# EAGLE design EpaperTeensyBoard (EAGLE 6.3)
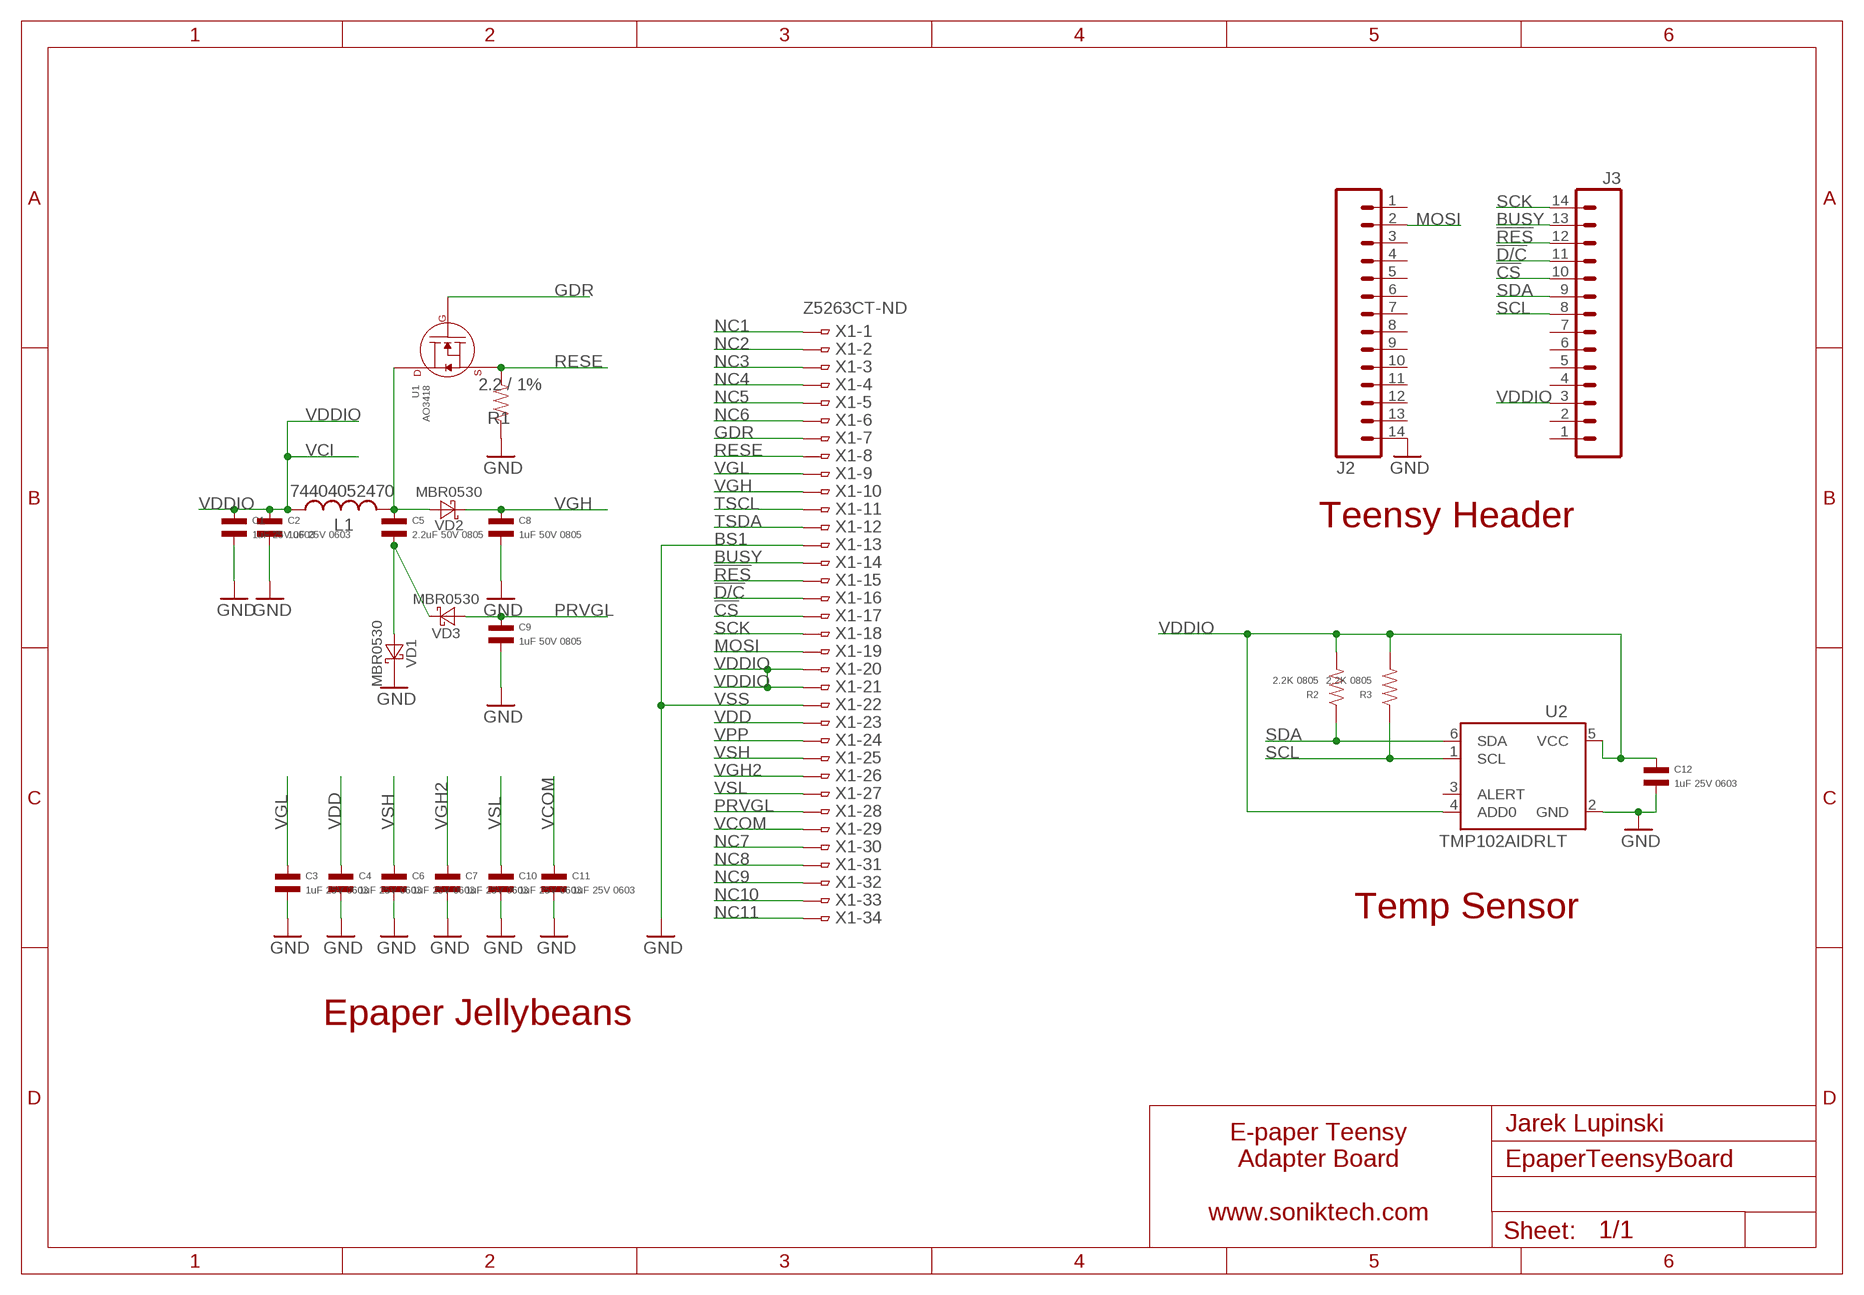
[diagram p0: schematic, sheet 1]

## Parts
C1  1uF 25V 0603  CAPACITOR_NP_0603  [C0603]
C2  1uF 25V 0603  CAPACITOR_NP_0603  [C0603]
C3  1uF 25V 0603  CAPACITOR_NP_0603  [C0603]
C4  1uF 25V 0603  CAPACITOR_NP_0603  [C0603]
C5  2.2uF 50V 0805  CAPACITOR_NP_0805  [C0805]
C6  1uF 25V 0603  CAPACITOR_NP_0603  [C0603]
C7  1uF 25V 0603  CAPACITOR_NP_0603  [C0603]
C8  1uF 50V 0805  CAPACITOR_NP_0805  [C0805]
C9  1uF 50V 0805  CAPACITOR_NP_0805  [C0805]
C10  1uF 25V 0603  CAPACITOR_NP_0603  [C0603]
C11  1uF 25V 0603  CAPACITOR_NP_0603  [C0603]
C12  1uF 25V 0603  CAPACITOR_NP_0603  [C0603]
J2  M14  [1X14]
J3  M14  [1X14]
L1  74404052470  L-USWE-TPC  [POWER-CHOKE_WE-TPC]
R1  2.2 / 1%  RESISTOR_0805  [R0805]
R2  2.2K 0805  RESISTOR_0805  [R0805]
R3  2.2K 0805  RESISTOR_0805  [R0805]
U1  AO3418  N-CHANNEL_FET_SOT-23-3  [SOT-23-3]
U2  TMP102AIDRLT  TMP102  [SOT563]
VD1  MBR0530  DIODE-SCHOTTKY-SOD123  [SOD123]
VD2  MBR0530  DIODE-SCHOTTKY-SOD123  [SOD123]
VD3  MBR0530  DIODE-SCHOTTKY-SOD123  [SOD123]
X1  Z5263CT-ND  FH12-34S-0.5S  [XF3M-34]

## Nets
!CS: J3.10 X1.17
!D/C: J3.11 X1.16
!RES: J3.12 X1.15
BUSY: J3.13 X1.14
GDR: U1.P$1(GATE) X1.7
GND [power]: C1.P$2 C2.P$2 C3.P$2 C4.P$2 C6.P$2 C7.P$2 C8.P$2 C9.P$2 C10.P$2 C11.P$2 C12.P$2 J2.14 R1.P$1 U2.2(GND) VD1.C X1.13 X1.22
MOSI: J2.2 X1.19
N$3: C5.P$1 L1.2 U1.P$3(DRAIN) VD2.A
N$6: C5.P$2 VD1.A VD3.C
NC1: X1.1
NC2: X1.2
NC3: X1.3
NC4: X1.4
NC5: X1.5
NC6: X1.6
NC7: X1.30
NC8: X1.31
NC9: X1.32
NC10: X1.33
NC11: X1.34
PRVGL: C9.P$1 VD3.A X1.28
RESE: R1.P$2 U1.P$2(SOURCE) X1.8
SCK: J3.14 X1.18
SCL: J3.8 R3.P$1 U2.1(SCL)
SDA: J3.9 R2.P$1 U2.6(SDA)
TSCL: X1.11
TSDA: X1.12
VCOM: C11.P$1 X1.29
VDD: C4.P$1 X1.23
VDDIO: C1.P$1 C2.P$1 C12.P$1 J3.3 L1.1 R2.P$2 R3.P$2 U2.4(ADD0) U2.5(VCC) X1.20 X1.21
VGH: C8.P$1 VD2.C X1.10
VGH2: C7.P$1 X1.26
VGL: C3.P$1 X1.9
VPP: X1.24
VSH: C6.P$1 X1.25
VSL: C10.P$1 X1.27
Unconnected: J2.1 J2.3 J2.4 J2.5 J2.6 J2.7 J2.8 J2.9 J2.10 J2.11 J2.12 J2.13 J3.1 J3.2 J3.4 J3.5 J3.6 J3.7 U2.3(ALERT)

## Notes on the sheet
- VCI
- Teensy Header
- BS1
- VSS
- Temp Sensor
- Epaper Jellybeans
- Jarek Lupinski
- E-paper Teensy
  Adapter Board
  
  www.soniktech.com

## Library data of the parts
C1-C12 = MF_Passives:CAPACITOR_NP: Library: MF_Passives Description: Device for Non-Polarized Capacitors. Manufacture part number (MPN) can be added via Attributes. Check https://factory.macrofab.com/parts for the house parts list.; POPULATE: 1
J2 J3 = SparkFun-Connectors:M14: Header 14 Standard 14-pin 0.1" header. Use with straight break away headers (SKU : PRT-00116), right angle break away headers (PRT-00553), swiss pins (PRT-00743), machine pins (PRT-00117), and female headers (PRT-00115).
L1 = rcl:L-US: INDUCTOR, American symbol
R1-R3 = MF_Passives:RESISTOR: Library: MF_Passives Description: Device for Resistors. Manufacture part number (MPN), Voltage, Tolerance, and Wattage Rating can be added via Attributes. Check https://factory.macrofab.com/parts for the house parts list.; POPULATE: 1
U1 = MF_Discrete_Semiconductor:N-CHANNEL_FET: Library: MF_Discrete_Semiconductor Description: Device for Single N-Channel Mosfet. Manufacture part number (MFG#) can be added via Attributes.; HOUSEPART: NO; POPULATE: 1
U2 = SparkFun-Sensors:TMP102: I2C degC temp sensor; PROD_ID: IC-09303; VALUE: TMP102
VD1-VD3 = diode:DIODE-SCHOTTKY-: SCHOTTKY DIODE
X1 = con-hirose:FH12-34S-0.5S: 0.5mm Pitch Connectors For FPC/FFC Source: Data sheet <http://www.hirose.co.jp/cataloge_hp/e58605370.pdf>

## Net classes
2 power: width 0.203 mm

## Board
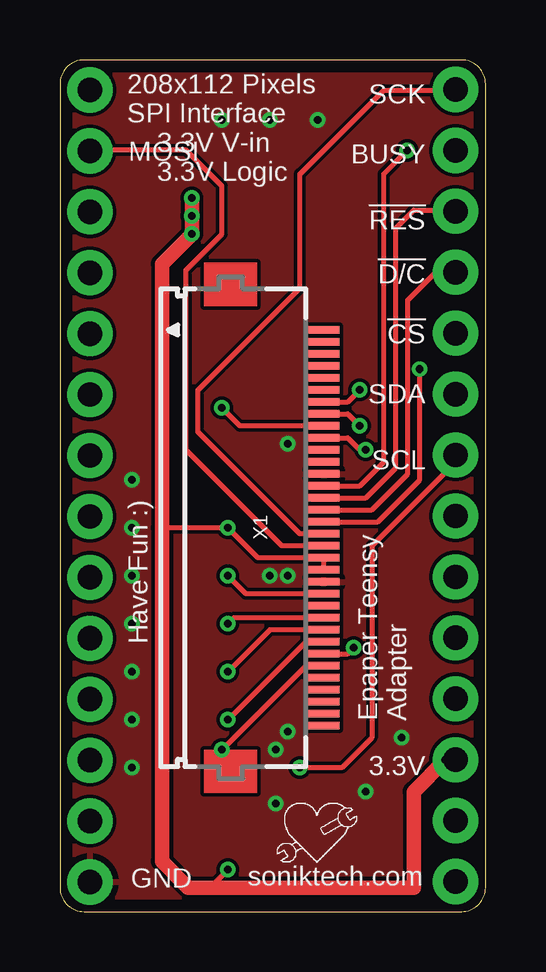
[diagram p1: board, top side]
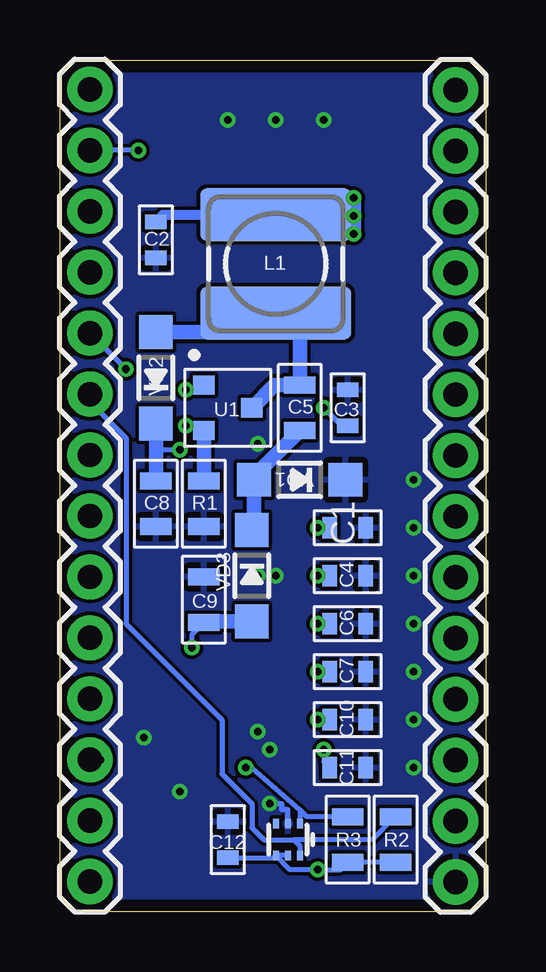
[diagram p2: board, bottom side, seen from below]

Size 17.75 x 35.5 mm. Coordinates in mm from the lower left corner, seen from the top.
Outline: 0,34.5 0,1 arc90 1,0 16.75,0 arc90 17.75,1 17.75,34.5 arc90 16.75,35.5 1,35.5 arc90 0,34.5
Copper layers (1*16): Top 0.035mm / dielectric 1.5mm / Bottom 0.035mm
Design rules "MF_Standard_2_Layer *": minimum track width 6mil, minimum drill 12mil, track to track 6mil, track to pad 6mil, pad to pad 5mil, via to via 8mil, smd to smd 0mil, copper to edge 20mil, drill to drill 10mil, minimum pad ring 6mil, minimum via ring 6mil, stop-mask expansion 2mil, vias tented up to drill 25mil, thermal gap 10mil

### Footprints (pad centres in the part's own frame; a part is rotated, then mirrored left to right if it is on the bottom)
C0603 = smd 0.6 x 0.9: P$1 -0.75,0; P$2 0.75,0
C0805 = smd 0.7 x 1.3: P$1 -0.95,0; P$2 0.95,0
1X14 = drill 1.016 pad 1.88: 1 0,0; 2 2.54,0; 3 5.08,0; 4 7.62,0; 5 10.16,0; 6 12.7,0; 7 15.24,0; 8 17.78,0; 9 20.32,0; 10 22.86,0; 11 25.4,0; 12 27.94,0; 13 30.48,0; 14 33.02,0
POWER-CHOKE_WE-TPC = smd 6.3 x 2.2: 1 0,2.05; 2 0,-2.05
R0805 = smd 0.7 x 1.3: P$1 -0.95,0; P$2 0.95,0
SOT-23-3 = smd 0.9 x 0.8: P$1 -1,0.95; P$2 -1,-0.95; P$3 1,0
SOT563 = smd 0.25 x 0.4: 1 -0.5,-0.66; 2 0,-0.66; 3 0.5,-0.66; 4 0.5,0.66; 5 0,0.66; 6 -0.5,0.67
SOD123 = smd 1.4 x 1.4: A 1.905,0; C -1.905,0
XF3M-34 = smd 0.3 x 1.3: 1 -8.25,3.25; 2 -7.75,3.25; 3 -7.25,3.25; 4 -6.75,3.25; 5 -6.25,3.25; 6 -5.75,3.25; 7 -5.25,3.25; 8 -4.75,3.25; 9 -4.25,3.25; 10 -3.75,3.25; 11 -3.25,3.25; 12 -2.75,3.25; 13 -2.25,3.25; 14 -1.75,3.25; 15 -1.25,3.25; 16 -0.75,3.25; 17 -0.25,3.25; 18 0.25,3.25; 19 0.75,3.25; 20 1.25,3.25; 21 1.75,3.25; 22 2.25,3.25; 23 2.75,3.25; 24 3.25,3.25; 25 3.75,3.25; 26 4.25,3.25; 27 4.75,3.25; 28 5.25,3.25; 29 5.75,3.25; 30 6.25,3.25; 31 6.75,3.25; 32 7.25,3.25; 33 7.75,3.25; 34 8.25,3.25

### Placement (x,y rotation side)
C1  5.75,16 0 bottom
C2  13.75,28 270 bottom
C3  5.75,21 90 bottom
C4  5.75,14 0 bottom
C5  7.75,21 270 bottom
C6  5.75,12 0 bottom
C7  5.75,10 0 bottom
C8  13.75,17 270 bottom
C9  11.75,13 90 bottom
C10  5.75,8 0 bottom
C11  5.75,6 0 bottom
C12  10.75,3 90 bottom
J2  1.25,34.25 270 bottom
J3  16.5,1.25 90 bottom
L1  8.75,27 0 bottom
R1  11.75,17 90 bottom
R2  3.75,3 270 bottom
R3  5.75,3 270 bottom
U1  10.75,21 0 bottom
U2  8.25,3 180 bottom
VD1  7.75,18 180 bottom
VD2  13.75,22.25 90 bottom
VD3  9.75,14 270 bottom
X1  7.75,16 270 top

### Tracks (layer width: path | path; a pad name or v marks a point on that pad's centre or on a via)
!CS  (via drill 0.33)
  Top 0.203: X1.17 13.25,16.25 15,18 v15,22.61
  Bottom 0.203: v15,22.61 J3.10
!D/C  (via drill 0.33)
  Top 0.203: X1.16 13,16.75 14.5,18.25 14.5,25.5 15.75,26.75 v16.4,26.75
  Bottom 0.203: v16.4,26.75 J3.11
!RES  (via drill 0.33)
  Top 0.203: X1.15 12.75,17.25 14,18.5 14,28.5 14.75,29.25 v16.44,29.25
  Bottom 0.203: v16.44,29.25 J3.12
BUSY  (via drill 0.33)
  Top 0.203: X1.14 12.5,17.75 13.5,18.75 13.5,30.75 v14.48,31.73
  Bottom 0.203: v14.48,31.73 J3.13
GDR  (via drill 0.33)
  Top 0.203: X1.7 12,21.25 v12.5,21.75
  Bottom 0.203: v12.5,21.75 11.95,21.75 U1.P$1
GND  (via drill 0.33)
  Bottom 0.203: U2.2 8.25,4.25 8.5,4.25 8.5,4.5 v9,4.5
  other vias: 9.5,19.5 6.75,33 8.75,33 10.75,33 8.75,14 9.5,14 9.5,7.5 9,6.75 12.75,5 14.25,7.25 3,6 3,8 3,10 3,12 3,14 3,16 3,18
  pour Bottom: -0.25,0 17.75,0 17.75,36 -0.25,36
  pour Top: -0.25,0 17.75,0 17.75,36 -0.25,36
MOSI  (via drill 0.33)
  Top 0.203: X1.19 9.25,15.25 5.25,19.25 5.25,26.75 6.75,28.25 6.75,30.25 5.25,31.75 v1.29,31.75
  Bottom 0.203: v1.29,31.75 J2.2
N$3
  Bottom 0.61: VD2.A 9.54,24.16 L1.2 7.75,23.95 C5.P$1 8.8,21.95 U1.P$3
N$6
  Bottom 0.61: C5.P$2 9.65,18.14 VD1.A 9.65,16 VD3.C
PRVGL  (via drill 0.33)
  Top 0.203: X1.28 12,10.75 v12.25,11
  Bottom 0.203: v12.25,11 12.25,11.55 C9.P$1
  Bottom 0.61: C9.P$1 11.75,12.1 VD3.A
RESE  (via drill 0.33)
  Top 0.203: X1.8 12,20.75 v12.5,20.25
  Bottom 0.203: v12.5,20.25 11.95,20.25 U1.P$2
  Bottom 0.61: R1.P$2 U1.P$2
SCK  (via drill 0.33)
  Top 0.203: X1.18 10,15.75 5.75,20 5.75,21.75 10,26 10,30.75 13.5,34.25 v16.48,34.25
  Bottom 0.203: v16.48,34.25 J3.14
SCL  (via drill 0.33)
  Top 0.203: v16.5,18.75 13,15.25 13,7.25 11.75,6 v10,6
  Bottom 0.203: J3.8 v16.5,18.75 | v10,6 9.75,6 7.75,4.25 | 7.75,4.25 U2.1 | R3.P$1 7.45,3.95 7.75,4.25
SDA  (via drill 0.33)
  Top 0.203: J3.9 v16.5,21.25
  Bottom 0.203: v16.5,21.25 15,19.75 15,12 11,8 11,5.75 9.75,4.5 9.75,3.5 9.25,3 8,3 | 8,3 7.75,2.75 U2.6 | R2.P$1 3.8,3.95 4.75,3 8,3
VCOM  (via drill 0.33)
  Top 0.203: X1.29 10.25,10.25 v6.75,6.75
  Bottom 0.203: v6.75,6.75 6.75,6.25 C11.P$1
VDD  (via drill 0.33)
  Top 0.203: X1.23 7.75,13.25 v7,14
  Bottom 0.203: v7,14 C4.P$1
VDDIO  (via drill 0.33)
  Top 0.203: v7,16 4.35,16 | 5.35,1 6.25,1 v7,1.75 | X1.21 X1.20 8.25,14.75 v7,16 | v7,16 4.25,16
  Top 0.61: v16.08,6.33 14.75,5 14.75,1 5.35,1 4.25,2.1 4.25,16 4.25,27 v5.5,28.25 v5.5,29.75 v5.5,29
  Bottom 0.203: v7,16 C1.P$1 | U2.5 U2.4 | U2.4 8.16,1.75 v7,1.75 6.05,1.75 R3.P$2 R2.P$2 | C12.P$1 8.84,2.25 U2.4
  Bottom 0.406: C2.P$1 13.45,29.05 L1.1
  Bottom 0.61: J3.3 v16.08,6.33 | v5.5,29 v5.5,28.25 v5.5,29.75 6.2,29.05 L1.1
VGH  (via drill 0.33)
  Top 0.203: X1.10 12,19.75 12.5,19.25 v12.75,19.25
  Bottom 0.203: v12.75,19.25 13.75,19.25
  Bottom 0.61: C8.P$1 13.75,19.25 VD2.C
VGH2  (via drill 0.33)
  Top 0.203: X1.26 8.75,11.75 v7,10
  Bottom 0.203: v7,10 C7.P$1
VGL  (via drill 0.33)
  Top 0.203: X1.9 7.5,20.25 v6.75,21
  Bottom 0.203: C3.P$1 6,20.25 v6.75,21
VSH  (via drill 0.33)
  Top 0.203: X1.25 7.25,12.25 v7,12
  Bottom 0.203: v7,12 C6.P$1
VSL  (via drill 0.33)
  Top 0.203: X1.27 10.25,11.25 v7,8
  Bottom 0.203: v7,8 C10.P$1

### Text on the board
tNames: SCK | BUSY | MOSI | 208x112 Pixels / SPI Interface / 3.3V V-in / 3.3V Logic | !RES | !D/C | !CS | SDA | SCL | Have Fun :) | Epaper Teensy / Adapter | 3.3V | soniktech.com | GND